# EAGLE schematic Infinity Mirror_c_unbuilt (EAGLE 9.3.0)
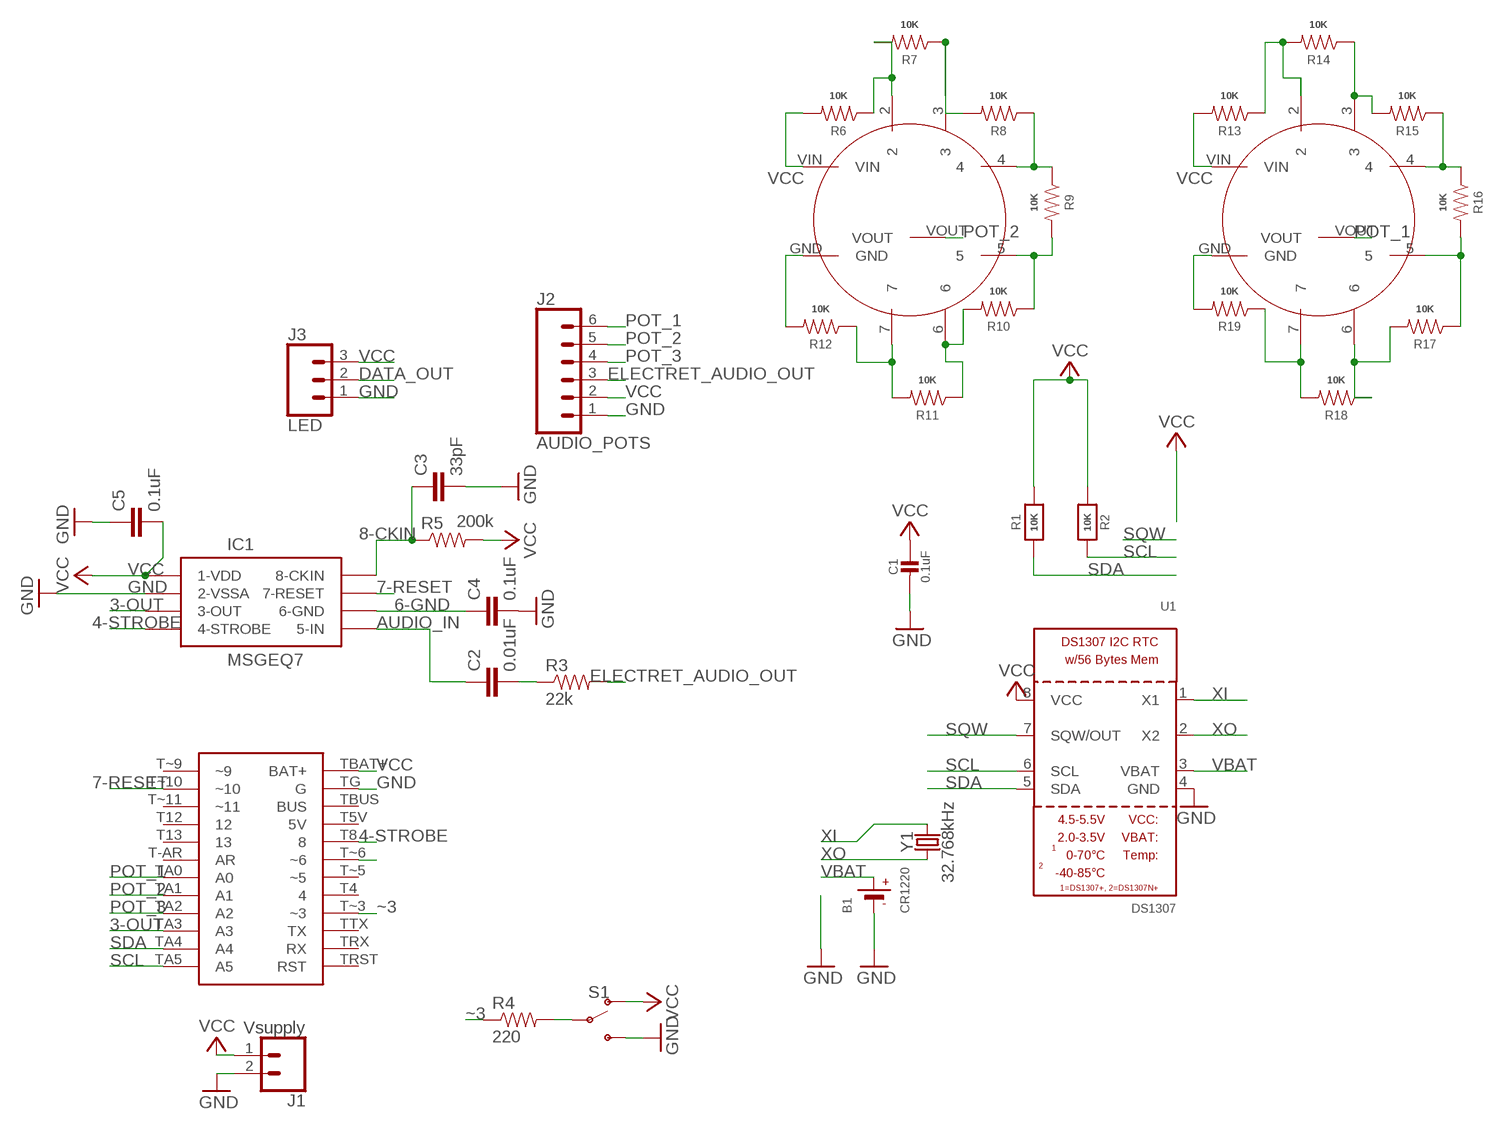
[diagram p0: schematic, sheet 1]

## Parts
B1  CR1220  BATTERYCR1220_SMT  [CR1220]
C1  0.1uF  CAP_CERAMIC0805-NOOUTLINE  [0805-NO]
C2  0.01uF  SPARKFUN-CAPACITORS_CAP0805  [SPARKFUN-CAPACITORS_0805]
C3  33pF  0.33UF/330NF-0805-50V-10%  [0805]
C4  0.1uF  SPARKFUN-CAPACITORS_CAP0805  [SPARKFUN-CAPACITORS_0805]
C5  0.1uF  SPARKFUN-CAPACITORS_CAP0805  [SPARKFUN-CAPACITORS_0805]
IC1  MSGEQ7P  MSGEQ7DIL  [DIP08]
J1  Vsupply  SPARKFUN-CONNECTORS_CONN_02LOCK  [SPARKFUN-CONNECTORS_1X02_LOCK]
J2  AUDIO_POTS  CONN_06SILK_FEMALE_PTH  [1X06]
J3  LED  CONN_03  [1X03]
R1  10K  RESISTOR0805_NOOUTLINE  [0805-NO]
R2  10K  RESISTOR0805_NOOUTLINE  [0805-NO]
R3  22k  SPARKFUN-PASSIVES_RESISTOR0805-RES  [SPARKFUN-PASSIVES_0805]
R4  220  SPARKFUN-PASSIVES_RESISTOR0805-RES  [SPARKFUN-PASSIVES_0805]
R5  200k  SPARKFUN-PASSIVES_RESISTOR0805-RES  [SPARKFUN-PASSIVES_0805]
R6  10K  SPARKFUN-PASSIVES_RESISTOR0805-RES  [SPARKFUN-PASSIVES_0805]
R7  10K  SPARKFUN-PASSIVES_RESISTOR0805-RES  [SPARKFUN-PASSIVES_0805]
R8  10K  SPARKFUN-PASSIVES_RESISTOR0805-RES  [SPARKFUN-PASSIVES_0805]
R9  10K  SPARKFUN-PASSIVES_RESISTOR0805-RES  [SPARKFUN-PASSIVES_0805]
R10  10K  SPARKFUN-PASSIVES_RESISTOR0805-RES  [SPARKFUN-PASSIVES_0805]
R11  10K  SPARKFUN-PASSIVES_RESISTOR0805-RES  [SPARKFUN-PASSIVES_0805]
R12  10K  SPARKFUN-PASSIVES_RESISTOR0805-RES  [SPARKFUN-PASSIVES_0805]
R13  10K  SPARKFUN-PASSIVES_RESISTOR0805-RES  [SPARKFUN-PASSIVES_0805]
R14  10K  SPARKFUN-PASSIVES_RESISTOR0805-RES  [SPARKFUN-PASSIVES_0805]
R15  10K  SPARKFUN-PASSIVES_RESISTOR0805-RES  [SPARKFUN-PASSIVES_0805]
R16  10K  SPARKFUN-PASSIVES_RESISTOR0805-RES  [SPARKFUN-PASSIVES_0805]
R17  10K  SPARKFUN-PASSIVES_RESISTOR0805-RES  [SPARKFUN-PASSIVES_0805]
R18  10K  SPARKFUN-PASSIVES_RESISTOR0805-RES  [SPARKFUN-PASSIVES_0805]
R19  10K  SPARKFUN-PASSIVES_RESISTOR0805-RES  [SPARKFUN-PASSIVES_0805]
S1  SWITCH-SPDT-PTH-11.6X4.0MM-LOCK  [SWITCH_SPDT_PTH_11.6X4.0MM_LOCK]
U1  DS1307  RTC_DS1307  [SOIC8_150MIL]
U$1  ADAFRUIT_PRO_TRINKET_NO-DIMENSION  [ARDUINO_PRO_TRINKET_5V_NO-DIMENSION]
U$2  ROTARY-SWITCH-8POS  [ROTARY-SWITCH-8POS]
U$3  ROTARY-SWITCH-8POS  [ROTARY-SWITCH-8POS]
Y1  32.768kHz  CRYSTAL-32.768KHZPTH-2X6  [CRYSTAL-PTH-2X6-CYL]

## Nets
3: R4.2 S1.2(P)
3-OUT: IC1.3(3-OUT) U$1.TA3(A3)
4-STROBE: IC1.4(4-STROBE) U$1.T8
6-GND: C4.1 IC1.6(6-GND)
7-RESET: IC1.7(7-RESET) U$1.T~10(~10)
8-CKIN: C3.1 IC1.8(8-CKIN) R5.1
AUDIO_IN: C2.1 IC1.5(5-IN)
DATA_OUT: J3.2 U$1.T~6(~6)
ELECTRET_AUDIO_OUT: J2.3 R3.2
GND: B1.- C1.2 C3.2 C4.2 C5.1 IC1.2(2-VSSA) J1.2 J2.1 J3.1 S1.3(S) U1.4(GND) U$1.TG(G)
N$1: R8.1 R9.1 U$2.4
N$2: R7.1 R8.2 U$2.3
N$3: R6.1 R7.2 U$2.2
N$5: R12.2 U$2.GND
N$6: R11.2 R12.1 U$2.7
N$7: R10.2 R11.1 U$2.6
N$8: C2.2 R3.1
N$9: R9.2 R10.1 U$2.5
N$12: R16.2 R17.1 U$3.5
N$13: R17.2 R18.1 U$3.6
N$14: R18.2 R19.1 U$3.7
N$15: R19.2 U$3.GND
N$17: R13.1 R14.2 U$3.2
N$18: R14.1 R15.2 U$3.3
N$19: R15.1 R16.1 U$3.4
POT_1: J2.6 U$1.TA0(A0) U$3.VOUT
POT_2: J2.5 U$1.TA1(A1) U$2.VOUT
POT_3: J2.4 U$1.TA2(A2)
SCL: R2.2 U1.6(SCL) U$1.TA5(A5)
SDA: R1.1 U1.5(SDA) U$1.TA4(A4)
SQW: U1.7(SQW/OUT)
VBAT: B1.+$1(+) U1.3(VBAT)
VCC: C1.1 C5.2 IC1.1(1-VDD) J1.1 J2.2 J3.3 R1.2 R2.1 R5.2 R6.2 R13.2 S1.1(O) U1.8(VCC) U$1.TBAT+(BAT+) U$2.VIN U$3.VIN
XI: U1.1(X1) Y1.2
XO: U1.2(X2) Y1.1
~3: R4.1 U$1.T~3(~3)
Unconnected: U$1.T4 U$1.T5V(5V) U$1.T12 U$1.T13 U$1.T-AR(AR) U$1.TBUS(BUS) U$1.TRST(RST) U$1.TRX(RX) U$1.TTX(TX) U$1.T~5(~5) U$1.T~9(~9) U$1.T~11(~11)

## Library data of the parts
B1 = microbuilder:BATTERY: CR1220 SMT - Digikey: 3001K-ND CD2032 BAT-HLD-001 - Digikey: BAT-HLD-001-ND
C1 = microbuilder:CAP_CERAMIC: Ceramic Capacitors For new designs, use the packages preceded by an '_' character since they are more reliable: The following footprints should be used on most boards: _0402 - Standard footprint for regular board layouts _0603 - Standard footprint for regular board layouts _0805 - Standard footprint for regular board layouts _1206 - Standard footprint for regular board layouts For extremely tight-pitch boards where space is at a premium, the following 'micro-pitch' footprints can be used (smaller pads, no silkscreen outline, etc.): _0402MP - Micro-pitch footprint for very dense/compact boards _0603MP - Micro-pitch footprint for very dense/compact boards _0805MP - Micro-pitch footprint for very dense/compact boards _1206MP - Micro-pitch footprint for very dense/compact boards
C2 C4 C5 = Terra_4.0_12_DIP_JJM_EB2_9-6-2018d:SPARKFUN-CAPACITORS_CAP: Capacitor Standard 0603 ceramic capacitor, and 0.1" leaded capacitor.
C3 = SparkFun-Capacitors:0.33UF/330NF: 0.33µF/330nF ceramic capacitors A capacitor is a passive two-terminal electrical component used to store electrical energy temporarily in an electric field.; PROD_ID: CAP-08469; VALUE: 0.33µF
IC1 = SparkFun-IC-Special-Function:MSGEQ7: 7-band graphic equalizer This IC is for making a 7 band/channel audio spectrometer. There are two versions of this part. The DIP available on the storefront, and the SO used in product. Datasheet <https://www.sparkfun.com/datasheets/Components/General/MSGEQ7.pdf> SparkFun Products Storefront component: Graphic Equalizer Display Filter - MSGEQ7 <https://www.sparkfun.com/products/10468> (COM-10468) SparkFun Spectrum Shield <https://www.sparkfun.com/products/13116> (DEV-13116); PROD_ID: IC-12196
J1 = RC1a_Main_2-20-2018_m:SPARKFUN-CONNECTORS_CONN_02: Multi connection point. Often used as Generic Header-pin footprint for 0.1 inch spaced/style header connections On any of the 0.1 inch spaced packages, you can populate with these: Break Away Headers - Straight <https://www.sparkfun.com/products/116> (PRT-00116) Break Away Male Headers - Right Angle <https://www.sparkfun.com/products/553> (PRT-00553) Female Headers <https://www.sparkfun.com/products/115> (PRT-00115) Break Away Headers - Machine Pin <https://www.sparkfun.com/products/117> (PRT-00117) Break Away Female Headers - Swiss Machine Pin <https://www.sparkfun.com/products/743> (PRT-00743) For SCREWTERMINALS and SPRING TERMINALS visit here: Screw Terimnals on SparkFun.com <https://www.sparkfun.com/search/results?term=Screw+Terminals> (5mm/3.5mm/2.54mm spacing) This device is also useful as a general connection point to wire up your design to another part of your project. Our various solder wires solder well into these plated through hole pads. Hook-Up Wire - Assortment (Stranded, 22 AWG) <https://www.sparkfun.com/products/11375> (PRT-11375) Hook-Up Wire - Assortment (Solid Core, 22 AWG) <https://www.sparkfun.com/products/11367> (PRT-11367) View the entire wire category on our website here <https://www.sparkfun.com/categories/141> Special notes: Molex polarized connector foot print use with: PRT-08233 with associated crimp pins and housings. 2.54_SCREWTERM for use with PRT-10571. 3.5mm Screw Terminal footprints for PRT-08084 5mm Screw Terminal footprints for use with PRT-08432
J2 = SparkFun-Connectors:CONN_06: Multi connection point. Often used as Generic Header-pin footprint for 0.1 inch spaced/style header connections On any of the 0.1 inch spaced packages, you can populate with these: Break Away Headers - Straight <https://www.sparkfun.com/products/116> (PRT-00116) Break Away Male Headers - Right Angle <https://www.sparkfun.com/products/553> (PRT-00553) Female Headers <https://www.sparkfun.com/products/115> (PRT-00115) Break Away Headers - Machine Pin <https://www.sparkfun.com/products/117> (PRT-00117) Break Away Female Headers - Swiss Machine Pin <https://www.sparkfun.com/products/743> (PRT-00743) Arduino Stackable Header - 6 Pin <https://www.sparkfun.com/products/9280> (PRT-09280) For SCREWTERMINALS and SPRING TERMINALS visit here: Screw Terimnals on SparkFun.com <https://www.sparkfun.com/search/results?term=Screw+Terminals> (5mm/3.5mm/2.54mm spacing) This device is also useful as a general connection point to wire up your design to another part of your project. Our various solder wires solder well into these plated through hole pads. Hook-Up Wire - Assortment (Stranded, 22 AWG) <https://www.sparkfun.com/products/11375> (PRT-11375) Hook-Up Wire - Assortment (Solid Core, 22 AWG) <https://www.sparkfun.com/products/11367> (PRT-11367) View the entire wire category on our website here <https://www.sparkfun.com/categories/141>; PROD_ID: CONN-08437
J3 = SparkFun-Connectors:CONN_03: Multi connection point. Often used as Generic Header-pin footprint for 0.1 inch spaced/style header connections On any of the 0.1 inch spaced packages, you can populate with these: Break Away Headers - Straight <https://www.sparkfun.com/products/116> (PRT-00116) Break Away Male Headers - Right Angle <https://www.sparkfun.com/products/553> (PRT-00553) Female Headers <https://www.sparkfun.com/products/115> (PRT-00115) Break Away Headers - Machine Pin <https://www.sparkfun.com/products/117> (PRT-00117) Break Away Female Headers - Swiss Machine Pin <https://www.sparkfun.com/products/743> (PRT-00743) Stackable Header - 3 Pin (Female, 0.1") <https://www.sparkfun.com/products/13875> (PRT-13875) For SCREWTERMINALS and SPRING TERMINALS visit here: Screw Terimnals on SparkFun.com <https://www.sparkfun.com/search/results?term=Screw+Terminals> (5mm/3.5mm/2.54mm spacing) This device is also useful as a general connection point to wire up your design to another part of your project. Our various solder wires solder well into these plated through hole pads. Hook-Up Wire - Assortment (Stranded, 22 AWG) <https://www.sparkfun.com/products/11375> (PRT-11375) Hook-Up Wire - Assortment (Solid Core, 22 AWG) <https://www.sparkfun.com/products/11367> (PRT-11367) View the entire wire category on our website here <https://www.sparkfun.com/categories/141> Special notes: Molex polarized connector foot print use with SKU : PRT-08232 with associated crimp pins and housings.
R1 R2 = microbuilder:RESISTOR: Resistors For new designs, use the packages preceded by an '_' character since they are more reliable: The following footprints should be used on most boards: _0402 - Standard footprint for regular board layouts _0603 - Standard footprint for regular board layouts _0805 - Standard footprint for regular board layouts _1206 - Standard footprint for regular board layouts For extremely tight-pitch boards where space is at a premium, the following 'micro-pitch' footprints can be used (smaller pads, no silkscreen outline, etc.): _0402MP - Micro-pitch footprint for very dense/compact boards _0603MP - Micro-pitch footprint for very dense/compact boards _0805MP - Micro-pitch footprint for very dense/compact boards _1206MP - Micro-pitch footprint for very dense/compact boards
R3-R19 = RC1a_Main_2-20-2018_m:SPARKFUN-PASSIVES_RESISTOR: Resistor Basic schematic elements and footprints for 0603, 1206, and PTH resistors.
S1 = SparkFun-Switches:SWITCH-SPDT: Single Pole, Double Throw (SPDT) Switch Single-pole, double-throw (SPDT) switch. Variant Overview SMD-AYZ0202 Surface Mount DPDT Switch <https://www.sparkfun.com/products/597> (COM-00597) Used on e.g. LilyPad Arduino USB - ATmega32U4 Board <https://www.sparkfun.com/products/12049> PTH-11.6X4.0MM SPDT Mini Power Switch <https://www.sparkfun.com/products/102> (COM-00102) Used on e.g. SparkFun Simon Says - Through-Hole Soldering Kit <https://www.sparkfun.com/products/10547> (KIT-10547) PTH-11.6X4.0MM-KIT KIT version of SPDT Mini Power Switch - Simplifies soldering by removing tStop of switch pins - only one side can be soldered. PTH-11.6X4.0MM-LOCK LOCK version of SPDT Mini Power Switch - Offset pins hold switch in place for easier soldering. SMD-RIGHT-ANGLE Surface Mount Right Angle Switch <https://www.sparkfun.com/products/10860> (COM-10860) Used on e.g. SparkFun ESP8266 Thing <https://www.sparkfun.com/products/13231>; PROD_ID: SWCH-08261; SF_SKU: COM-00102
U1 = microbuilder:RTC_DS1307: DS1307 I2C RTC with 56-Bytes RAM
U$1 = _111_IH:ADAFRUIT_PRO_TRINKET_NO-DIMENSION
U$2 U$3 = _111_IH:ROTARY-SWITCH-8POS
Y1 = SparkFun-Clocks:CRYSTAL-32.768KHZ: 32.768kHz Crystal Frequency: 32.768kHz Frequency Stability: ±20ppm Load Capacitance: 12.5pF (PTH-2X6 & SMD-3.2X1.5), 6pF (SMD-2X6) SparkFun Products: SparkFun BigTime Watch Kit <https://www.sparkfun.com/products/11734> SparkFun nRF52832 Breakout <https://www.sparkfun.com/products/13990> SparkFun Real Time Clock Module <https://www.sparkfun.com/products/12708>; PROD_ID: XTAL-10112